# Altium project knock_driver_AD.PrjPcb
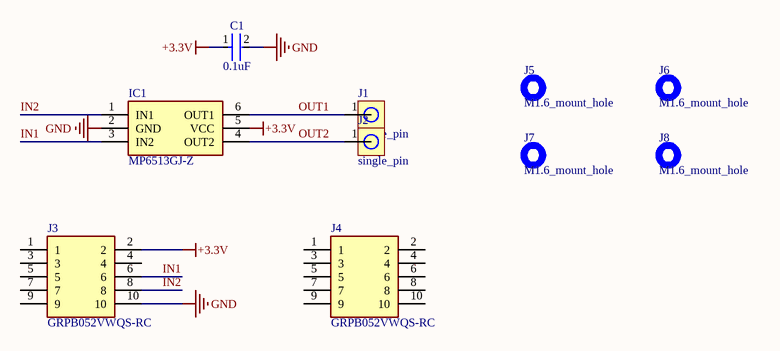
[diagram p0: Sheet1.SchDoc]
1 sheet, 10 parts. Net scope: global (net labels, ports and power ports of the same name join across sheets).
Board file: PCB1.PcbDoc

## Sheet Sheet1.SchDoc
size A4; Organization: Altium Limited; Address1: L3, 12a Rodborough Rd; Address2: Frenchs Forest; Address3: NSW; Address4: Australia 2086; SheetNumber: 1; SheetTotal: 1

### Parts
C1  0.1uF  [FP-GCM188-0_1-IPC_B]
IC1  MP6513GJ-Z  [SOT95P280X100-6N]
J1  single_pin  [1mm_single_pin_thr]
J2  single_pin  [1mm_single_pin_thr]
J3  GRPB052VWQS-RC  [HUSSP10W40P127_2X5_635X340X400P]
J4  GRPB052VWQS-RC  [HUSSP10W40P127_2X5_635X340X400P]
J5  M1.6_mount_hole  [M1.6_mount_hole]
J6  M1.6_mount_hole  [M1.6_mount_hole]
J7  M1.6_mount_hole  [M1.6_mount_hole]
J8  M1.6_mount_hole  [M1.6_mount_hole]

### Nets
+3.3V: C1.1 IC1.5(VCC) J3.2
GND: C1.2 IC1.2(GND) J3.10
IN1: IC1.3(IN2) J3.6
IN2: IC1.1(IN1) J3.8
OUT1: IC1.6(OUT1) J1.1
OUT2: IC1.4(OUT2) J2.1

Not connected (* = marked no-connect by the designer): J3 1 3 4 5 7 9; J4 1 2 3 4 5 6 7 8 9 10

### Notes on the sheet
- Design:
- Title:
- Fangzheng Liu
- Revision:
- Date:
- Time:

### Library data of the parts
C1 = CMP-2006-02353-3: Ceramic Capacitor for Automotive 100nF  ±10% 50VDC X8L 0603 Paper T/R; Voltage Rating: 50V; Height: 0.8mm; Lead Free: Lead Free; Case/Package: 0603; Dielectric: X8L; Packaging: Tape and Reel; Termination: SMD/SMT; Package Quantity: 4000; Width: 0.5mm; Max Operating Temperature: 150°C; Case Code (Metric): 1608; Thickness: 0.035inch; Capacitance: 100nF; Tolerance: 10%; Voltage Rating (DC): 50V; Ratings: AEC-Q200; Case Code (Imperial): 0603; Voltage: 50V; Depth: 0.8mm; Radiation Hardening: No; Length: 1.6mm; Mount: Surface Mount; Min Operating Temperature: -55°C
IC1 = MP6513GJ-Z: Integrated Circuit; Manufacturer_Name: Monolithic Power Systems (MPS); Datasheet Link: https://www.mouser.com/datasheet/2/277/MP6513_r1.0-1384349.pdf; Height: 1mm; Manufacturer_Part_Number: MP6513GJ-Z; Mouser Part Number: 946-MP6513GJ-Z; Mouser Price/Stock: https://www.mouser.co.uk/ProductDetail/Monolithic-Power-Systems-MPS/MP6513GJ-Z?qs=FfNbArp%252BdljFzTtslD%252B1UQ%3D%3D
J1 J2 = single_pin: single pin header
J3 J4 = GRPB052VWQS-RC: Connector; Manufacturer_Name: Sullins; Datasheet Link: http://www.sullinscorp.com/catalogs/82_PAGE90-91_.050_MALE_HDR_ST_RA_SMT.pdf; Manufacturer_Part_Number: GRPB052VWQS-RC